# EAGLE design BLDC_schematic_v12 (EAGLE 9.6.2)
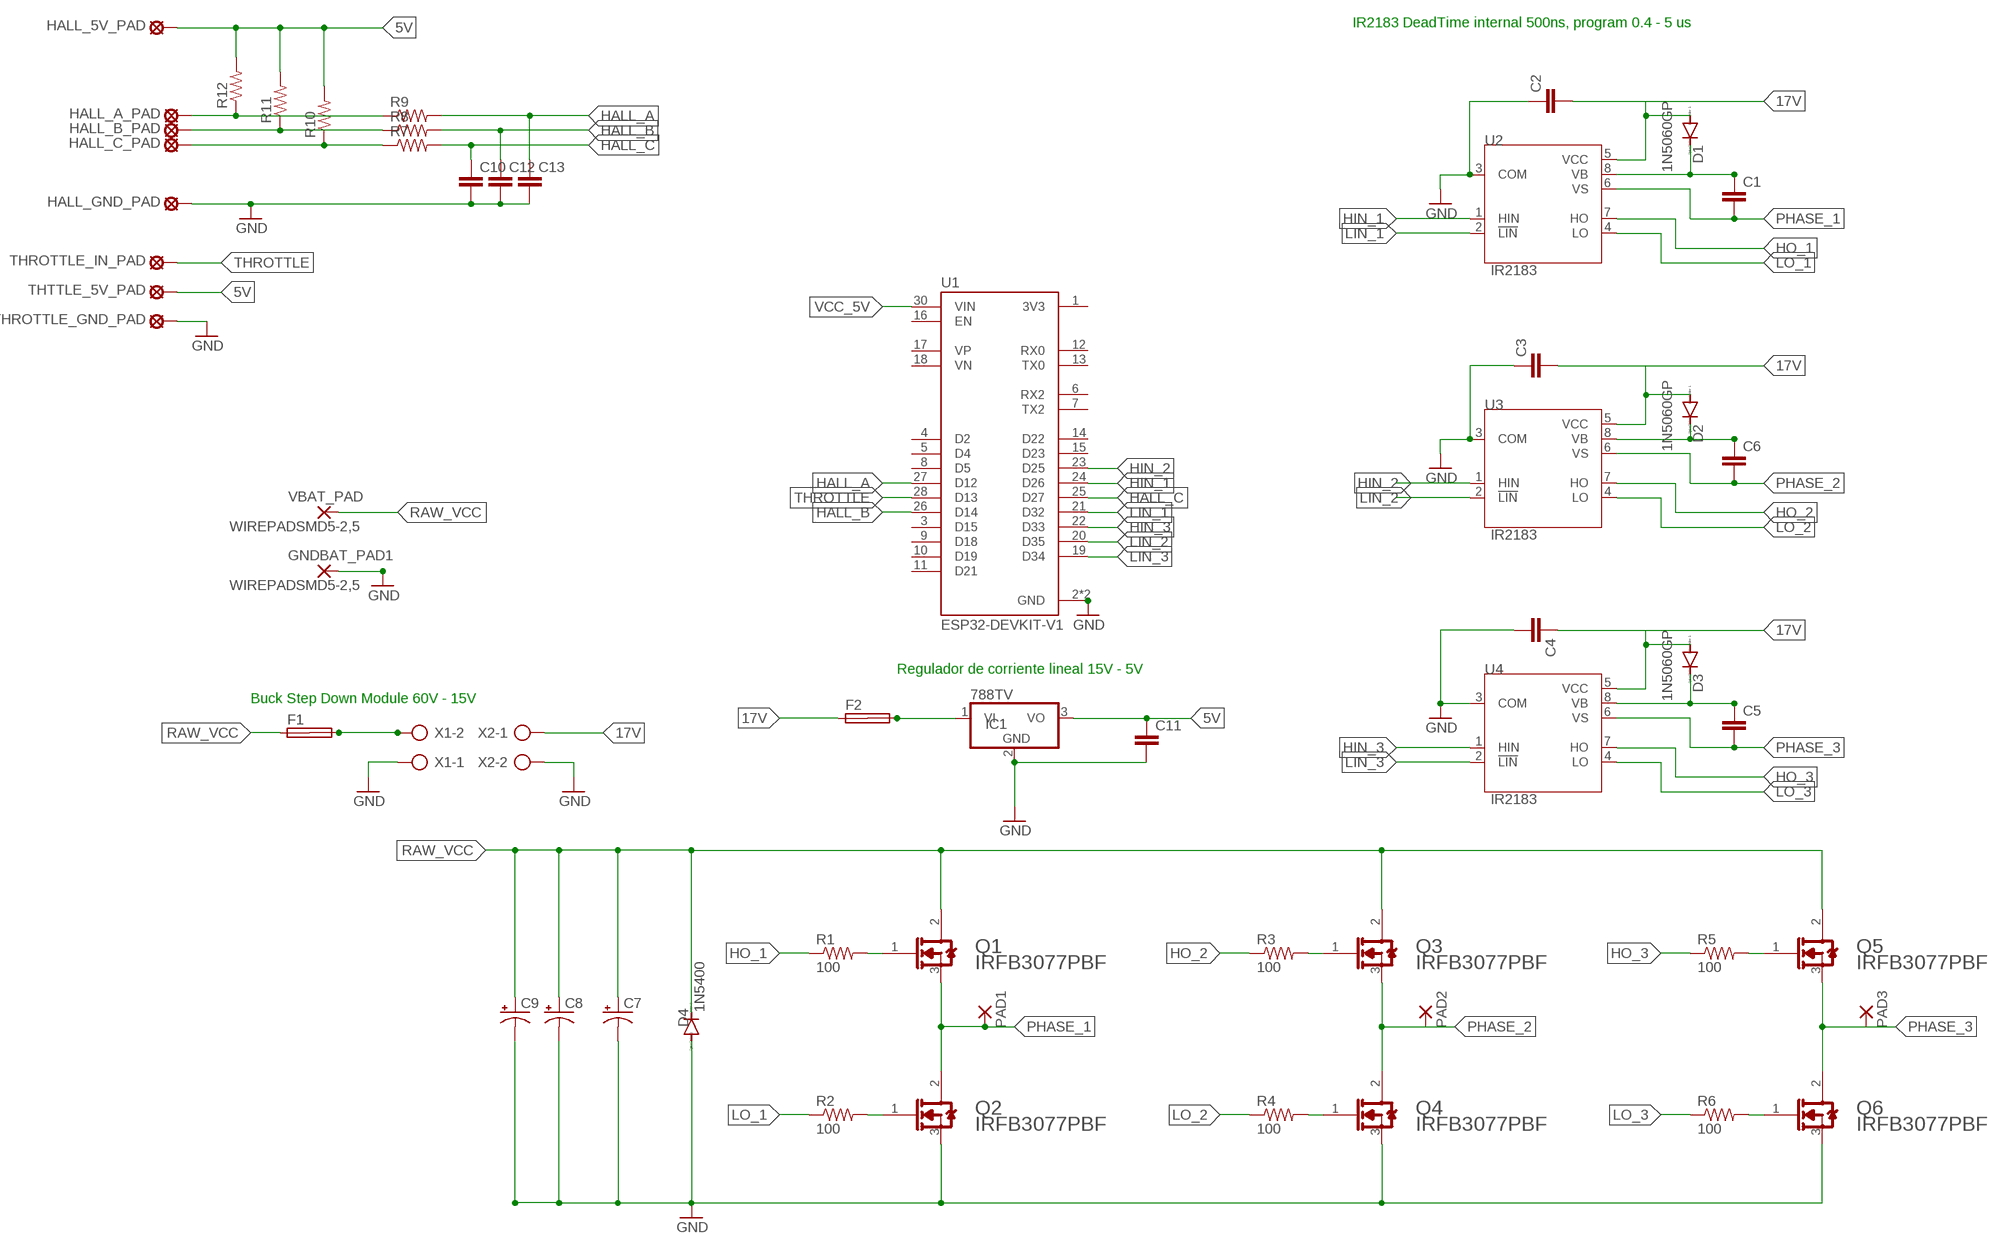
[diagram p0: schematic, sheet 1]

## Parts
C1  C-EU025-030X050  [C025-030X050]
C2  C-EU025-030X050  [C025-030X050]
C3  C-EU025-030X050  [C025-030X050]
C4  C-EU025-030X050  [C025-030X050]
C5  C-EU025-030X050  [C025-030X050]
C6  C-EU025-030X050  [C025-030X050]
C7  CPOL-USTT5D11  [TT5D11]
C8  CPOL-USTT5D11  [TT5D11]
C9  CPOL-USTT5D11  [TT5D11]
C10  C-EU025-030X050  [C025-030X050]
C11  C-EU025-030X050  [C025-030X050]
C12  C-EU025-030X050  [C025-030X050]
C13  C-EU025-030X050  [C025-030X050]
D1  1N5060GP  [DO15-12]
D2  1N5060GP  [DO15-12]
D3  1N5060GP  [DO15-12]
D4  1N5400  [DO201-15]
F1  SHK20Q  [SHK20Q]
F2  SHK20Q  [SHK20Q]
GNDBAT_PAD1  WIREPADSMD5-2,5  [5-2,5]
HALL_5V_PAD  MCS08  [MCS08]
HALL_A_PAD  MCS08  [MCS08]
HALL_B_PAD  MCS08  [MCS08]
HALL_C_PAD  MCS08  [MCS08]
HALL_GND_PAD  MCS08  [MCS08]
IC1  788TV  [TO220V]
PAD1  SMD5  [SMD2,54-5,08]
PAD2  SMD5  [SMD2,54-5,08]
PAD3  SMD5  [SMD2,54-5,08]
Q1  INFINEON_IRFB3077PBFINFINEON_IRFB3077PBF_0_0  [INFINEON_IRFB3077PBF_0]
Q2  INFINEON_IRFB3077PBFINFINEON_IRFB3077PBF_0_0  [INFINEON_IRFB3077PBF_0]
Q3  INFINEON_IRFB3077PBFINFINEON_IRFB3077PBF_0_0  [INFINEON_IRFB3077PBF_0]
Q4  INFINEON_IRFB3077PBFINFINEON_IRFB3077PBF_0_0  [INFINEON_IRFB3077PBF_0]
Q5  INFINEON_IRFB3077PBFINFINEON_IRFB3077PBF_0_0  [INFINEON_IRFB3077PBF_0]
Q6  INFINEON_IRFB3077PBFINFINEON_IRFB3077PBF_0_0  [INFINEON_IRFB3077PBF_0]
R1  100  R-US_0207/10  [0207/10]
R2  100  R-US_0207/10  [0207/10]
R3  100  R-US_0207/10  [0207/10]
R4  100  R-US_0207/10  [0207/10]
R5  100  R-US_0207/10  [0207/10]
R6  100  R-US_0207/10  [0207/10]
R7  R-US_0204/7  [0204/7]
R8  R-US_0204/7  [0204/7]
R9  R-US_0204/7  [0204/7]
R10  R-US_0204/7  [0204/7]
R11  R-US_0204/7  [0204/7]
R12  R-US_0204/7  [0204/7]
THROTTLE_GND_PAD  MCS08  [MCS08]
THROTTLE_IN_PAD  MCS08  [MCS08]
THTTLE_5V_PAD  MCS08  [MCS08]
U1  ESP32-DEVKIT-V1  [MODULE_ESP32_DEVKIT_V1]
U2  IR2183  [DIP762W45P254L1092H533Q8]
U3  IR2183  [DIP762W45P254L1092H533Q8]
U4  IR2183  [DIP762W45P254L1092H533Q8]
VBAT_PAD  WIREPADSMD5-2,5  [5-2,5]
X1  AK500/2-H  [AK500/2-H]
X2  AK500/2-H  [AK500/2-H]

## Nets
5V: C11.1 HALL_5V_PAD.MP IC1.3(VO) R10.2 R11.2 R12.2 THTTLE_5V_PAD.MP
17V: C2.2 C3.2 C4.1 F2.1A X2.1
GND: C2.1 C3.1 C4.2 C7.- C8.- C9.- C10.2 C12.2 C13.2 D4.A GNDBAT_PAD1.1(P) HALL_GND_PAD.MP Q2.3(S) Q4.3(S) Q6.3(S) THROTTLE_GND_PAD.MP U1.2(GND) U1.29(GND) U2.3(COM) U3.3(COM) U4.3(COM) X1.1 X2.2
HALL_A: C13.1 R9.2 U1.27(D12)
HALL_B: C12.1 R8.2 U1.26(D14)
HALL_C: C10.1 R7.2 U1.25(D27)
HIN_1: U1.24(D26) U2.1(HIN)
HIN_2: U1.23(D25) U3.1(HIN)
HIN_3: U1.22(D33) U4.1(HIN)
HO_1: R1.1 U2.7(HO)
HO_2: R3.1 U3.7(HO)
HO_3: R5.1 U4.7(HO)
LIN_1: U1.21(D32) U2.2(!LIN)
LIN_2: U1.20(D35) U3.2(!LIN)
LIN_3: U1.19(D34) U4.2(!LIN)
LO_1: R2.1 U2.4(LO)
LO_2: R4.1 U3.4(LO)
LO_3: R6.1 U4.4(LO)
N$1: C6.1 D2.C U3.8(VB)
N$2: C5.1 D3.C U4.8(VB)
N$3: C1.1 D1.C U2.8(VB)
N$4: C11.2 IC1.2(GND) ; supply symbol labelled GND
N$5: F1.2A X1.2
N$6: Q3.1(G) R3.2
N$7: Q1.1(G) R1.2
N$8: Q2.1(G) R2.2
N$9: Q4.1(G) R4.2
N$10: D3.A U4.5(VCC)
N$11: Q5.1(G) R5.2
N$12: Q6.1(G) R6.2
N$13: F2.2A IC1.1(VI)
N$14: HALL_A_PAD.MP R9.1 R12.1
N$15: HALL_B_PAD.MP R8.1 R11.1
N$16: HALL_C_PAD.MP R7.1 R10.1
N$18: D2.A U3.5(VCC)
N$20: D1.A U2.5(VCC)
PHASE_1: C1.2 PAD1.1(P) Q1.3(S) Q2.2(D) U2.6(VS)
PHASE_2: C6.2 PAD2.1(P) Q3.3(S) Q4.2(D) U3.6(VS)
PHASE_3: C5.2 PAD3.1(P) Q5.3(S) Q6.2(D) U4.6(VS)
RAW_VCC: C7.+ C8.+ C9.+ D4.C F1.1A Q1.2(D) Q3.2(D) Q5.2(D) VBAT_PAD.1(P)
THROTTLE: THROTTLE_IN_PAD.MP U1.28(D13)
VCC_5V: U1.30(VIN)
Unconnected: F1.1B F1.2B F2.1B F2.2B U1.1(3V3) U1.3(D15) U1.4(D2) U1.5(D4) U1.6(RX2) U1.7(TX2) U1.8(D5) U1.9(D18) U1.10(D19) U1.11(D21) U1.12(RX0) U1.13(TX0) U1.14(D22) U1.15(D23) U1.16(EN) U1.17(VP) U1.18(VN)

## Notes on the sheet
- IR2183 DeadTime internal 500ns, program 0.4 - 5 us
- Regulador de corriente lineal 15V - 5V
- Buck Step Down Module 60V - 15V

## Library data of the parts
C1-C6 C10-C13 = rcl:C-EU: CAPACITOR, European symbol; SPICEPREFIX: C
C7-C9 = rcl:CPOL-US: POLARIZED CAPACITOR, American symbol; SPICEPREFIX: C
D1-D3 = diode:1N5060GP: DIODE controlled avalanche rectifier
D4 = diode:1N5400: DIODE standard rectifier, 3 A, 50 V (Motorola)
F1 F2 = fuse:SHK20Q: FUSE HOLDER 5 x 20 mm, SH contact, E1207 Buerklin 64G6061; OC_FARNELL: unknown; OC_NEWARK: unknown
GNDBAT_PAD1 VBAT_PAD = wirepad:WIREPAD: Wire PAD connect wire on PCB
HALL_5V_PAD HALL_A_PAD HALL_B_PAD HALL_C_PAD HALL_GND_PAD THROTTLE_GND_PAD THROTTLE_IN_PAD THTTLE_5V_PAD = solpad:MCS08: SOLDER PAD MC S0,8, drill 1.2 mm, distributor Buerklin, 08F130
IC1 = linear:78*: Positive VOLTAGE REGULATOR Source: http://cache.national.com/ds/LM/LM78L05.pdf http://www.fairchildsemi.com/ds/LM/LM7805.pdf
PAD1-PAD3 = wirepad:SMD5: SMD PAD
Q1-Q6 = Infineon - IRFB3077PBF:INFINEON_IRFB3077PBF: N-Channel 75 V 120A (Tc) 370W (Tc) Through Hole TO-220AB; AUTOMOTIVE: No; CENTROID_NOT_SPECIFIED: No; CONTINUOUS_DRAIN_CURRENT: 210A; DATASHEET: https://www.infineon.com/dgdl/Infineon-IRFB3077-DataSheet-v01_01-EN.pdf?fileId=5546d462533600a4015356153f0d1def; DEPLETION_MODE: False; DEVICE_CLASS_L1: Discrete Semiconductors; DEVICE_CLASS_L2: Transistors; DEVICE_CLASS_L3: MOSFETs; DIGIKEY_DESCRIPTION: MOSFET N-CH 75V 120A TO220AB; DIGIKEY_PART_NUMBER: IRFB3077PBF-ND; DRAIN_TO_SOURCE_BREAKDOWN_VOLTAGE: 75V; DRAIN_TO_SOURCE_RESISTANCE: 2.8mΩ; DRAIN_TO_SOURCE_VOLTAGE: 75V; FOOTPRINT_URL: https://www.infineon.com/cms/en/product/packages/PG-TO220/PG-TO220-3-904/; FOOTPRINT_VARIANT_NAME_0: Recommended_Land_Pattern; GATE_CHARGE_AT_VGS: 160nC @ 10V; GATE_TO_SOURCE_VOLTAGE: 20V; HEIGHT: 19.15mm; INPUT_CAPACITACE_AT_VDS: 9400pF @ 50V; LEAD_FREE: Yes; MAX_FORWARD_DIODE_VOLTAGE: 1.3V; MAX_JUNCTION_TEMP: +175°C; MF: Infineon; MFG_PACKAGE_IDENT: PG-TO220-3; MFG_PACKAGE_IDENT_COMPONENT_ID: 23a5373a371ebf18; MFG_PACKAGE_IDENT_DATE: 0; MFG_PACKAGE_IDENT_REV: 904; MOUSER_PART_NUMBER: 942-IRFB3077PBF; MPN: IRFB3077PBF; NUMBER_OF_CHANNELS: 1; NUMBER_OF_N_CHANNELS: 1; PACKAGE: TO-220AB; POWER_DISSIPATION: 370W; PREFIX: Q; PULSE_DRAIN_CURRENT: 850A; REVERSE_RECOVERY_CHARGE: 59nC; REVERSE_RECOVERY_TIME: 42ns; ROHS: Yes; RTHJA_MAX: 62°C/W; STANDOFF_HEIGHT: 3.56mm; TECHNOLOGY: NA; TEMPERATURE_RANGE_HIGH: +175°C; TEMPERATURE_RANGE_LOW: -55°C; THRESHOLD_VGS_MAX: 4V; THRESHOLD_VGS_MIN: 2V; TURN_OFF_DELAY_TIME: 69ns; TURN_ON_DELAY_TIME: 25ns; VERIFICATION_VERSION: 0.0.0.3
R1-R12 = rcl:R-US_: RESISTOR, American symbol; SPICEPREFIX: R
U1 = ESP32-DEVKIT-V1:ESP32-DEVKIT-V1: Dual core, Wi-Fi: 2.4 GHz up to 150 Mbits/s,BLE (Bluetooth Low Energy) and legacy Bluetooth, 32 bits, Up to 240 MHz Check availability <https://pricing.snapeda.com/parts/ESP32-DEVKIT-V1/Do%20it/view-part?ref=eda>; AVAILABILITY: Not in stock; DESCRIPTION: Dual core, Wi-Fi: 2.4 GHz up to 150 Mbits/s,BLE (Bluetooth Low Energy) and legacy Bluetooth, 32 bits, Up to 240 MHz; MF: Do it; MP: ESP32-DEVKIT-V1; PACKAGE: None; PRICE: None
U2-U4 = IR2183:IR2183: MOSFET DRVR 600V 2.3A 2-OUT Hi/Lo Side Half Brdg Inv/Non-Inv 8-Pin PDIP Check availability <https://pricing.snapeda.com/parts/IR2183/Infineon/view-part?ref=eda>; AVAILABILITY: In Stock; DESCRIPTION: Half-Bridge Gate Driver IC Inverting, Non-Inverting 14-SOIC; MF: Infineon; MP: IR2183; PACKAGE: DIP-8 International Rectifier; PRICE: None; PURCHASE-URL: https://pricing.snapeda.com/search/part/IR2183/?ref=eda
X1 X2 = con-ptr500:AK500/2-H: CONNECTOR Aug. 2004 / PTR Meßtechnik: Die Bezeichnung der Serie AK505 wurde geändert. Es handelt sich hierbei um AK500 in horizontaler Ausführung.; OC_FARNELL: unknown; OC_NEWARK: unknown

## Module HOLE
Ports: 

### Library data of the parts

## Net classes
0 default: clearance 0.205 mm

## Board
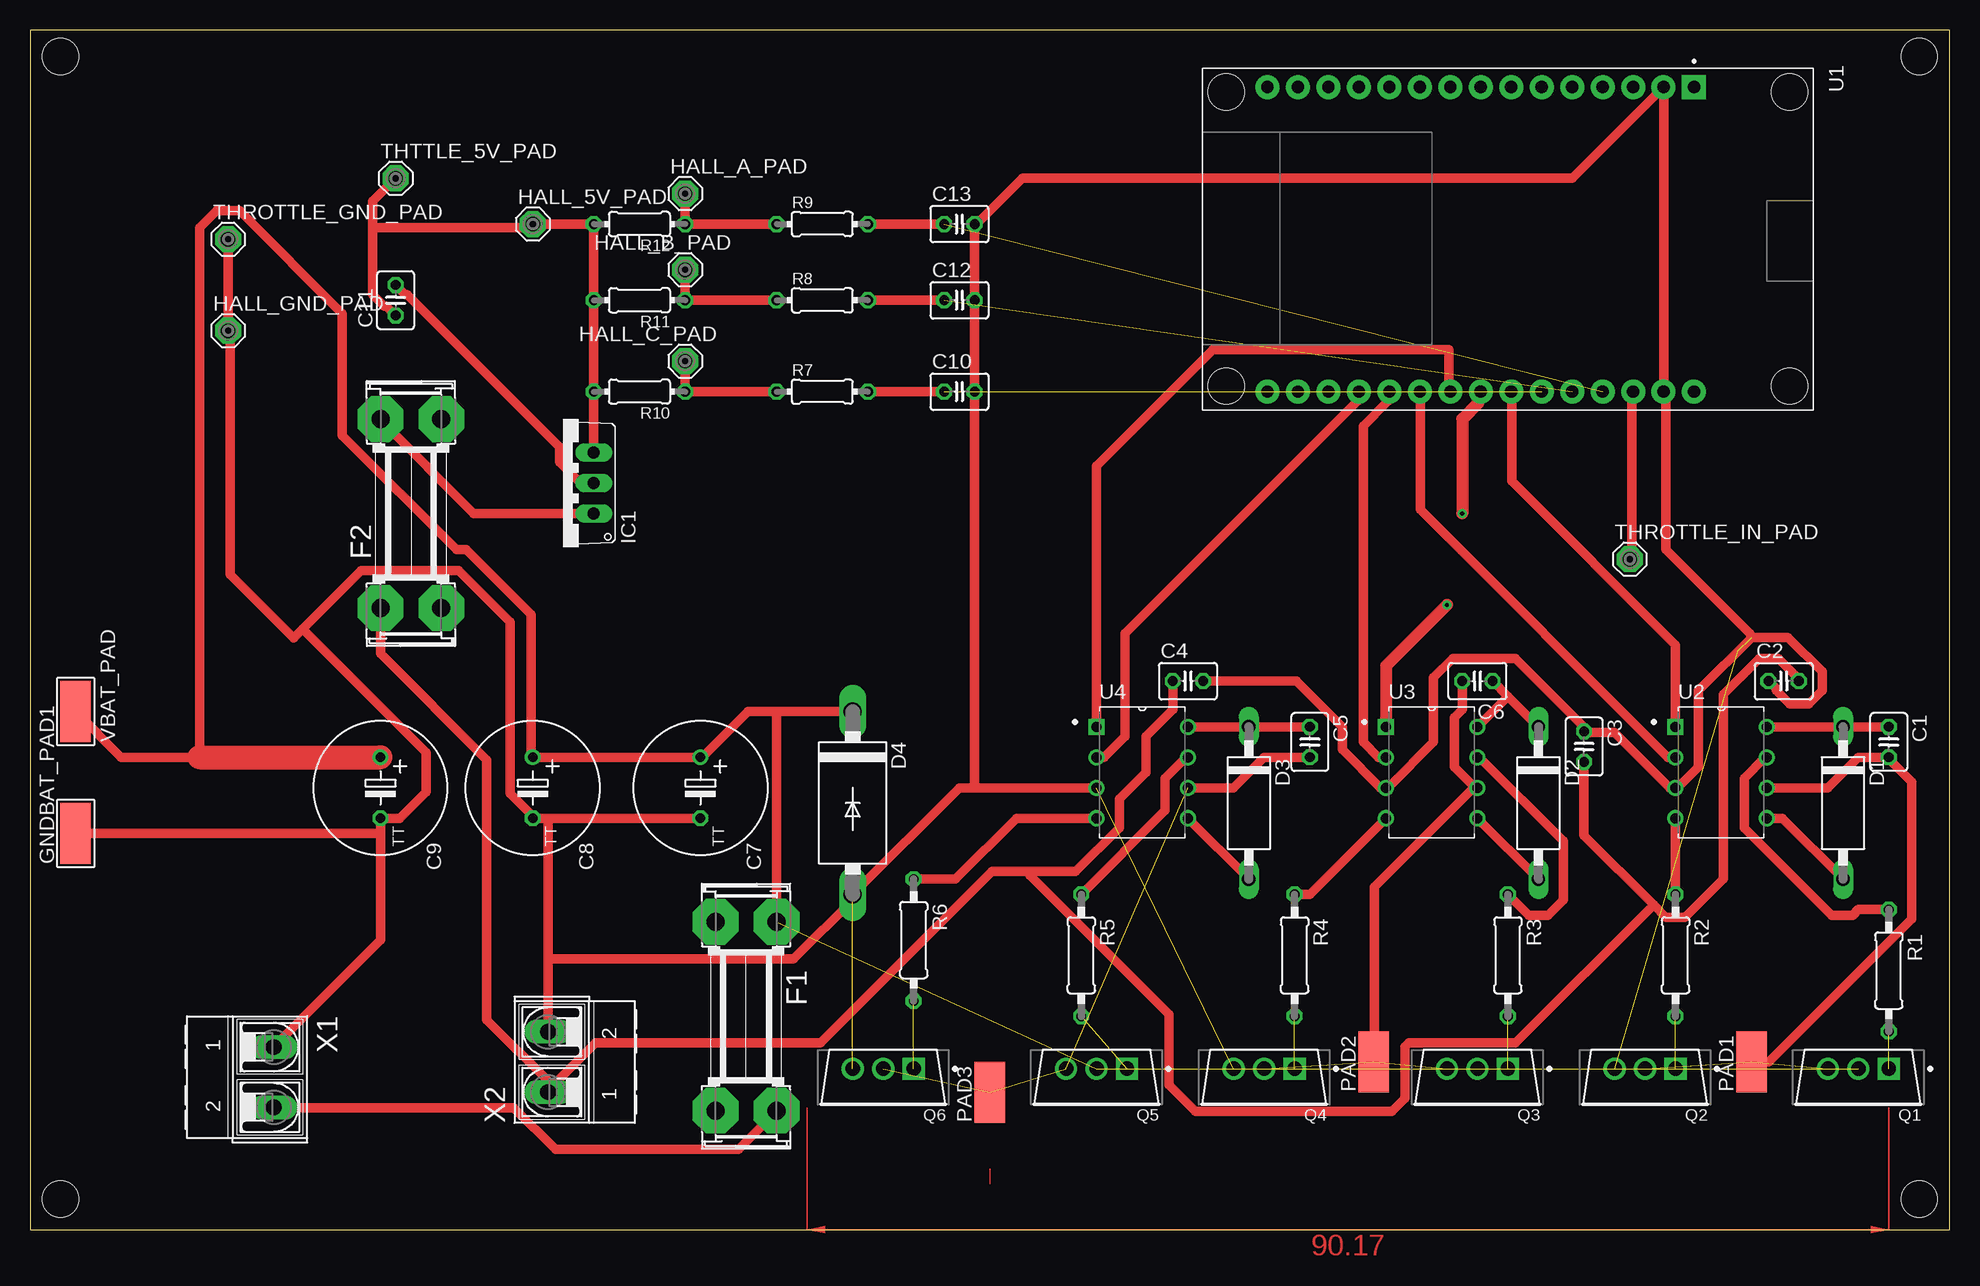
[diagram p1: board, top side]
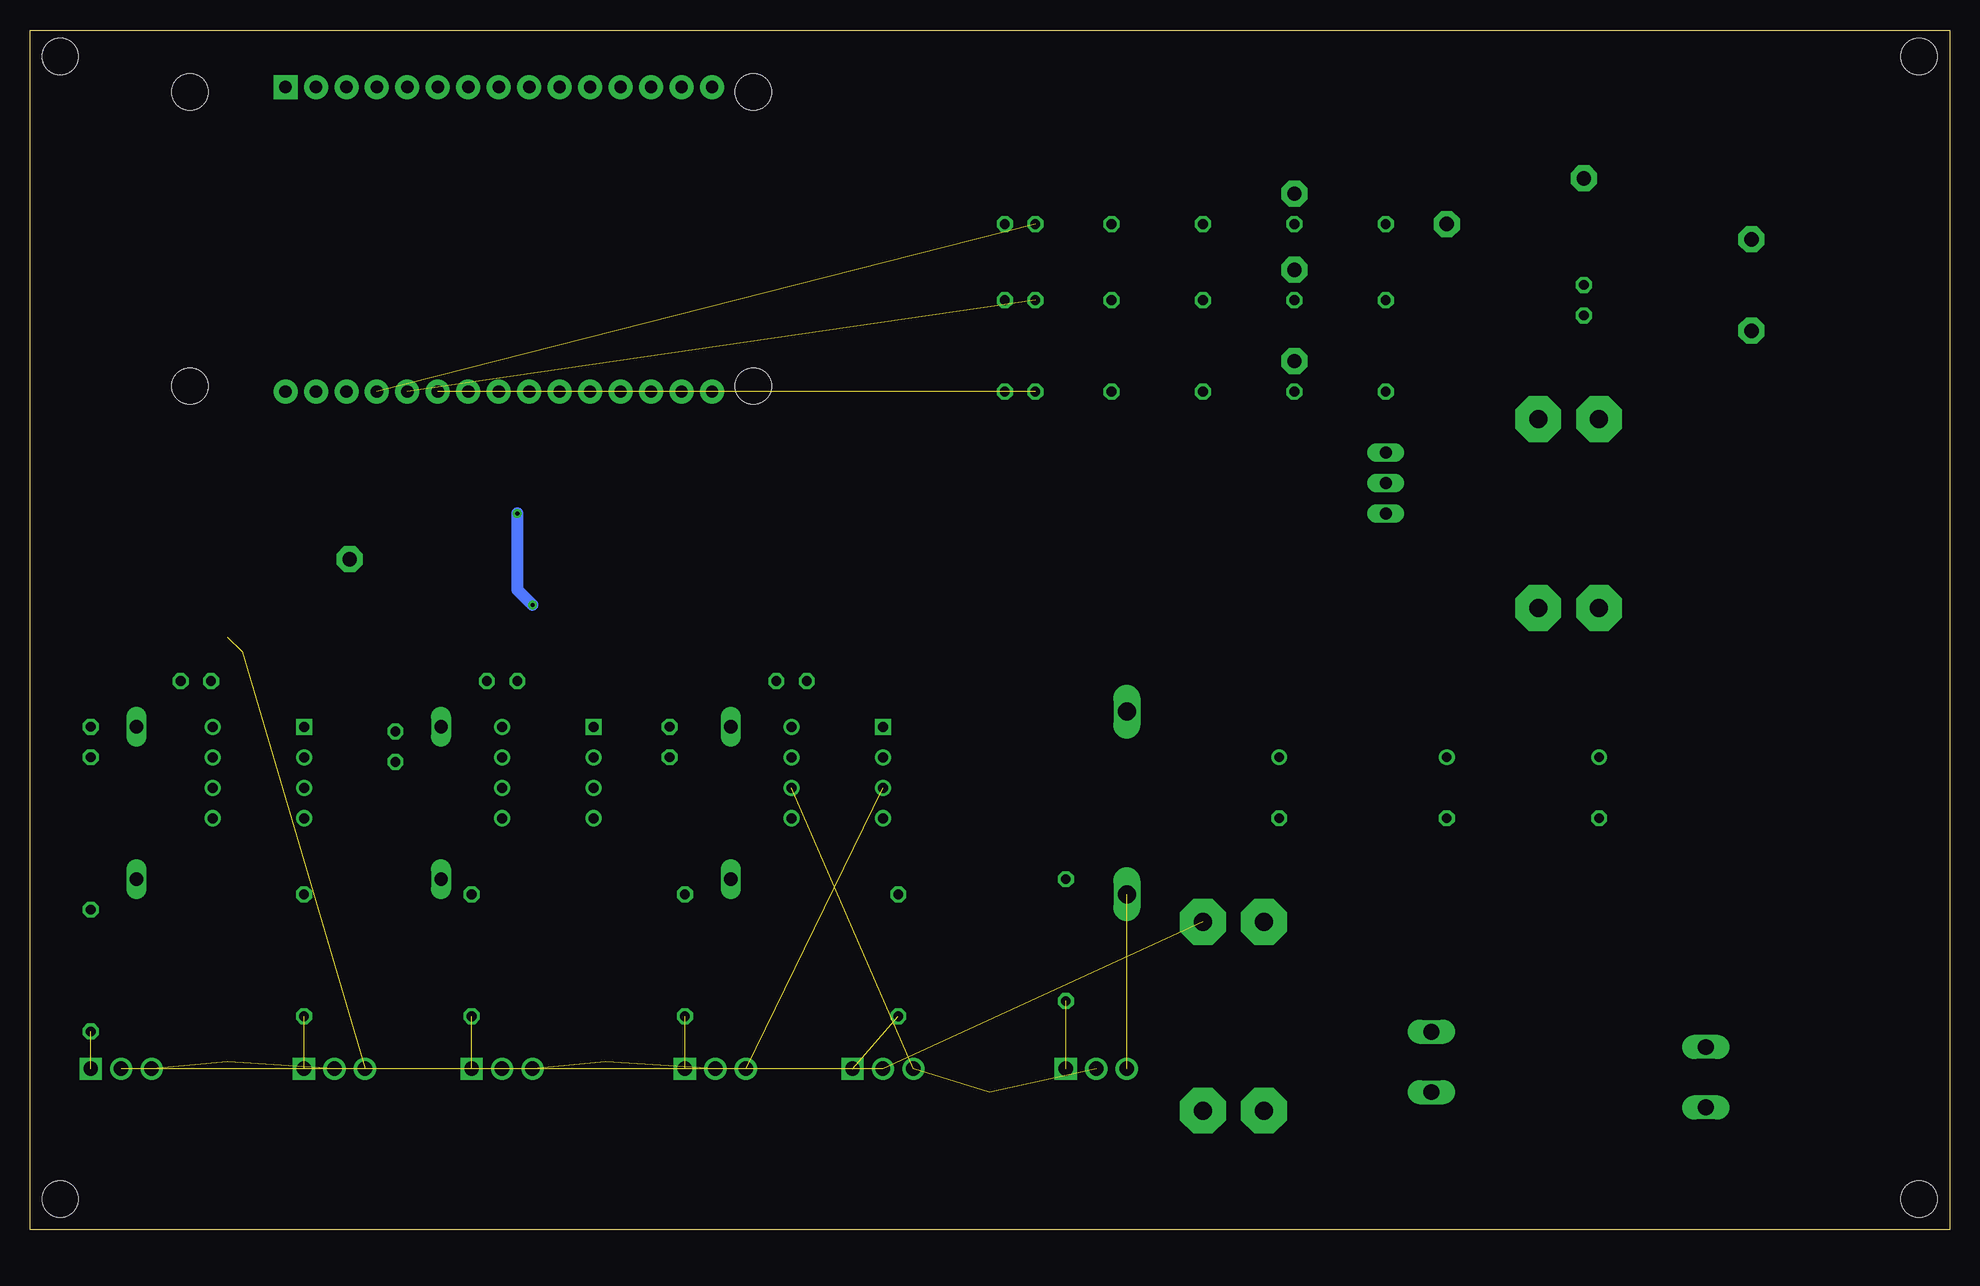
[diagram p2: board, bottom side, seen from below]

Size 160 x 100 mm. Coordinates in mm from the lower left corner, seen from the top.
Outline: 0,0 160,0 160,100 0,100 0,0
Copper layers (1*16): Top 0.035mm / dielectric 1.5mm / Bottom 0.035mm
Design rules "default *": minimum track width 0.8mm, minimum drill 0.35mm, track to track 0.8mm, track to pad 0.8mm, pad to pad 6mil, via to via 6mil, smd to smd 6mil, copper to edge 40mil, drill to drill 6mil, minimum pad ring 10mil, minimum via ring 8mil, stop-mask expansion 4mil, vias tented up to drill 0mil, thermal gap 10mil
Holes 3 mm at 157.48,97.79 157.48,2.54 2.54,2.54 2.54,97.79

### Footprints (pad centres in the part's own frame; a part is rotated, then mirrored left to right if it is on the bottom)
C025-030X050 = drill 0.813 octagon: 1 -1.27,0; 2 1.27,0
TT5D11 = drill 0.813: + -2.54,0 | drill 0.813 octagon: - 2.54,0
DO15-12 = drill 1.118 long: A 6.35,0; C -6.35,0
DO201-15 = drill 1.499 long: A 7.62,0; C -7.62,0
SHK20Q = drill 1.5 pad 3.81 octagon: 1A -7.874,2.54; 1B -7.874,-2.54; 2A 7.874,2.54; 2B 7.874,-2.54
5-2,5 = smd 2.54 x 5.08: 1 0,0
MCS08 = drill 1.194 pad 2.159 octagon: MP 0,0
TO220V = drill 1.016 long: 1 -2.54,-2.54; 2 0,-2.54; 3 2.54,-2.54
SMD2,54-5,08 = smd 2.54 x 5.08: 1 0,0
INFINEON_IRFB3077PBF_0 = drill 1.2 pad 1.85 square: 1 -0.705,2.54 | drill 1.2 pad 1.85: 2 -0.705,0; 3 -0.705,-2.54
0207/10 = drill 0.813 octagon: 1 -5.08,0; 2 5.08,0
0204/7 = drill 0.813 octagon: 1 -3.81,0; 2 3.81,0
MODULE_ESP32_DEVKIT_V1 = drill 1.02 pad 2 square: 1 -12.7,15.515 | drill 1.02 pad 2: 2 -12.7,12.975; 3 -12.7,10.435; 4 -12.7,7.895; 5 -12.7,5.355; 6 -12.7,2.815; 7 -12.7,0.275; 8 -12.7,-2.265; 9 -12.7,-4.805; 10 -12.7,-7.345; 11 -12.7,-9.885; 12 -12.7,-12.425; 13 -12.7,-14.965; 14 -12.7,-17.505; 15 -12.7,-20.045; 16 12.7,-20.045; 17 12.7,-17.505; 18 12.7,-14.965; 19 12.7,-12.425; 20 12.7,-9.885; 21 12.7,-7.345; 22 12.7,-4.805; 23 12.7,-2.265; 24 12.7,0.275; 25 12.7,2.815; 26 12.7,5.355; 27 12.7,7.895; 28 12.7,10.435; 29 12.7,12.975; 30 12.7,15.515 | hole 3: -12.28,-23.475; 12.23,-23.475; 12.23,23.475; -12.28,23.475
DIP762W45P254L1092H533Q8 = drill 0.83 square: 1 -3.81,3.81 | drill 0.83: 2 -3.81,1.27; 3 -3.81,-1.27; 4 -3.81,-3.81; 5 3.81,-3.81; 6 3.81,-1.27; 7 3.81,1.27; 8 3.81,3.81
AK500/2-H = drill 1.321 long: 1 -2.515,0; 2 2.515,0

### Placement (x,y rotation side)
C1  154.94,40.64 270 top
C2  146.18,45.72 0 top
C3  129.54,40.26 270 top
C4  96.52,45.72 0 top
C5  106.68,40.64 270 top
C6  120.65,45.72 180 top
C7  55.88,36.83 270 top
C8  41.91,36.83 270 top
C9  29.21,36.83 270 top
C10  77.47,69.85 0 top
C11  30.48,77.47 90 top
C12  77.47,77.47 0 top
C13  77.47,83.82 0 top
D1  151.13,35.56 270 top
D2  125.73,35.56 270 top
D3  101.6,35.56 270 top
D4  68.58,35.56 270 top
F1  59.69,17.78 270 top
F2  31.75,59.69 90 top
GNDBAT_PAD1  3.81,33.02 0 top
HALL_5V_PAD  41.91,83.82 0 top
HALL_A_PAD  54.61,86.36 0 top
HALL_B_PAD  54.61,80.01 0 top
HALL_C_PAD  54.61,72.39 0 top
HALL_GND_PAD  16.51,74.93 0 top
IC1  44.45,62.23 90 top
PAD1  143.51,13.97 0 top
PAD2  112.01,13.97 0 top
PAD3  80.01,11.43 0 top
Q1  152.4,12.7 270 top
Q2  134.62,12.7 270 top
Q3  120.65,12.7 270 top
Q4  102.87,12.7 270 top
Q5  88.9,12.7 270 top
Q6  71.12,12.7 270 top
R1  154.94,21.59 270 top
R2  137.16,22.86 270 top
R3  123.19,22.86 270 top
R4  105.41,22.86 270 top
R5  87.63,22.86 270 top
R6  73.66,24.13 270 top
R7  66.04,69.85 0 top
R8  66.04,77.47 0 top
R9  66.04,83.82 0 top
R10  50.8,69.85 180 top
R11  50.8,77.47 180 top
R12  50.8,83.82 180 top
THROTTLE_GND_PAD  16.51,82.55 0 top
THROTTLE_IN_PAD  133.35,55.88 0 top
THTTLE_5V_PAD  30.48,87.63 0 top
U1  123.19,82.55 270 top
U2  140.97,38.1 0 top
U3  116.84,38.1 0 top
U4  92.71,38.1 0 top
VBAT_PAD  3.81,43.18 0 top
X1  20.32,12.7 270 top
X2  43.18,13.97 90 top

### Tracks (layer width: path | path; a pad name or v marks a point on that pad's centre or on a via)
5V
  Top 0.8: C11.1 29.69,76.99 29.53,76.99 28.57,77.95 28.57,83.5 | 28.57,83.5 28.57,85.72 THTTLE_5V_PAD.MP | IC1.3 R10.2 R11.2 R12.2 HALL_5V_PAD.MP 41.75,83.5 28.57,83.5
17V
  Top 0.8: C3.2 129.54,32.86 135.33,27.07 | 135.33,27.07 136.37,26.04 137.95,26.04 141.13,29.21 141.13,44.61 144.15,47.62 145.73,47.62 147.32,46.04 147.32,45.72 C2.2 | C4.1 95.25,43.34 93.03,41.12 93.03,38.1 90.81,35.88 90.81,33.5 87.15,29.84 83.34,29.84 | 83.34,29.84 80.17,29.84 65.88,15.56 47.15,15.56 43.18,11.59 X2.1 43.34,12.22 38.07,17.49 38.07,39.15 29.21,48.01 F2.1A | 135.33,27.07 123.83,15.56 114.94,15.56 114.62,15.24 114.62,10.95 113.51,9.84 97.16,9.84 94.93,12.06 94.93,17.94 83.34,29.53 83.34,29.84
GND  (4 unrouted)
  Top 0.8: C4.2 105.57,45.72 109.38,41.91 109.38,40.01 112.55,36.83 U3.3 113.35,36.99 117,40.64 117,46.04 118.59,47.62 123.83,47.62 129.54,41.91 C3.1 129.54,41.43 132.08,41.43 136.68,36.83 U2.3 137.48,36.99 139.06,38.58 139.06,44.93 143.51,49.37 | 143.51,49.37 146.53,49.37 149.38,46.51 149.38,44.93 148.27,43.81 146.69,43.81 145.57,44.93 145.57,45.09 144.94,45.72 C2.1 | 143.51,49.37 143.35,49.69 136.37,56.67 136.37,69.53 U1.29 136.21,69.85 136.21,95.25 U1.2 128.54,87.63 82.71,87.63 79.06,83.98 C13.2 C12.2 C10.2 78.74,36.83 | THROTTLE_GND_PAD.MP HALL_GND_PAD.MP 16.67,74.61 16.67,54.61 21.99,49.29 22.75,50.05 | 29.21,33.02 29.21,24.13 20.32,15.24 X1.1 | 29.21,33.02 C9.- 30.83,34.29 33.02,36.48 33.02,39.78 22.75,50.05 | 29.21,33.02 GNDBAT_PAD1.1 3.43,33.02 | C7.- 43.18,34.29 | 43.18,34.29 C8.- 41.75,34.61 40.01,36.35 40.01,50.64 35.72,54.93 27.62,54.93 22.75,50.05 | 43.18,34.29 43.18,22.54 | 43.18,22.54 X2.2 | 78.74,36.83 77.47,36.83 D4.A 68.74,27.62 63.66,22.54 43.18,22.54 | 78.74,36.83 U4.3
HALL_A  (1 unrouted)
  Top 0.8: C13.1 R9.2
HALL_B  (1 unrouted)
  Top 0.8: C12.1 R8.2
HALL_C  (1 unrouted)
  Top 0.8: C10.1 R7.2
HIN_1
  Top 0.8: U2.1 137.16,48.74 123.51,62.39 123.51,69.85 U1.24
HIN_2  (via drill 0.35)
  Top 1.016: U1.23 120.69,69.62 120.69,68.89 119.38,67.58 v119.38,59.69 | v118.11,52.07 113.03,46.99 U3.1
  Bottom 1.016: v119.38,59.69 119.38,53.34 v118.11,52.07
HIN_3
  Top 0.8: U4.1 88.9,63.66 98.58,73.34 118.27,73.34 118.27,69.85 U1.22
HO_1
  Top 0.8: R1.1 152.4,26.67 151.92,26.19 150.18,26.19 142.88,33.5 142.88,37.62 144.62,39.37 U2.7
HO_2
  Top 0.8: R3.1 124.94,26.19 126.52,26.19 127.79,27.46 127.79,32.38 120.81,39.37 U3.7
HO_3
  Top 0.8: R5.1 94.61,34.92 94.61,37.62 96.36,39.37 U4.7
LIN_1
  Top 0.8: U2.2 136.53,39.37 115.89,60.01 115.89,69.85 U1.21
LIN_2
  Top 0.8: U3.2 112.39,39.37 111.12,40.64 111.12,66.99 113.19,69.06 113.19,69.85 U1.20
LIN_3
  Top 0.8: U4.2 89.53,39.37 91.28,41.12 91.28,49.69 110.65,69.06 110.65,69.85 U1.19
LO_1
  Top 0.8: U2.4 R2.1
LO_2
  Top 0.8: R4.1 106.68,27.94 U3.4
LO_3
  Top 0.8: R6.1 77.15,29.21 82.23,34.29 U4.4
N$1
  Top 0.8: D2.C 123.19,44.45 | 123.19,44.45 C6.1 | 123.19,44.45 U3.8
N$2
  Top 0.8: C5.1 D3.C U4.8
N$3
  Top 0.8: C1.1 D1.C U2.8
N$4
  Top 0.8: C11.2 31.27,77.95 31.43,77.95 44.13,65.25 44.13,63.98 45.88,62.23 IC1.2
N$5
  Top 0.8: X1.2 20.32,10.16 40.32,10.16 43.81,6.67 59.05,6.67 62.23,9.84 F1.2A
N$6  (1 unrouted)
N$7  (1 unrouted)
N$8  (1 unrouted)
N$9  (1 unrouted)
N$10
  Top 0.8: D3.A U4.5
N$11  (1 unrouted)
N$12  (1 unrouted)
N$13
  Top 0.8: IC1.1 36.99,59.69 29.21,67.47 F2.2A
N$14
  Top 0.8: HALL_A_PAD.MP R12.1 R9.1
N$15
  Top 0.8: HALL_B_PAD.MP R11.1 R8.1
N$16
  Top 0.8: HALL_C_PAD.MP R10.1 R7.1
N$18
  Top 0.8: D2.A U3.5
N$20
  Top 0.8: U2.5 146.05,34.29 D1.A
PHASE_1  (2 unrouted)
  Top 0.8: U2.6 149.86,36.83 152.4,39.37 C1.2 155.1,39.05 156.84,37.31 156.84,25.88 144.94,13.97 PAD1.1
PHASE_2  (2 unrouted)
  Top 0.8: C6.2 119.38,43.34 118.75,42.7 118.75,38.58 120.49,36.83 U3.6 120.17,36.67 112.08,28.57 112.08,13.97 PAD2.1
PHASE_3  (3 unrouted)
  Top 0.8: C5.2 102.87,39.37 100.33,36.83 U4.6
RAW_VCC  (3 unrouted)
  Top 0.8: VBAT_PAD.1 7.62,39.37 14.13,39.37 14.13,83.5 15.56,84.93 17.46,84.93 26.04,76.36 26.04,66.2 35.56,56.67 36.35,56.67 41.75,51.28 41.75,39.69 C8.+ C7.+ 56.2,39.53 59.85,43.18 62.23,43.18 | 62.23,43.18 D4.C | 62.23,43.18 F1.1A
  Top 2: 14.13,39.37 C9.+
THROTTLE
  Top 0.8: THROTTLE_IN_PAD.MP 133.51,56.04 133.51,69.85 U1.28
(copper drawn outside any net)
  shapes: Top area x2